# Altium schematic sheet Analouge.SchDoc
size A3; DocumentNumber: 5; SheetNumber: 5; SheetTotal: 8
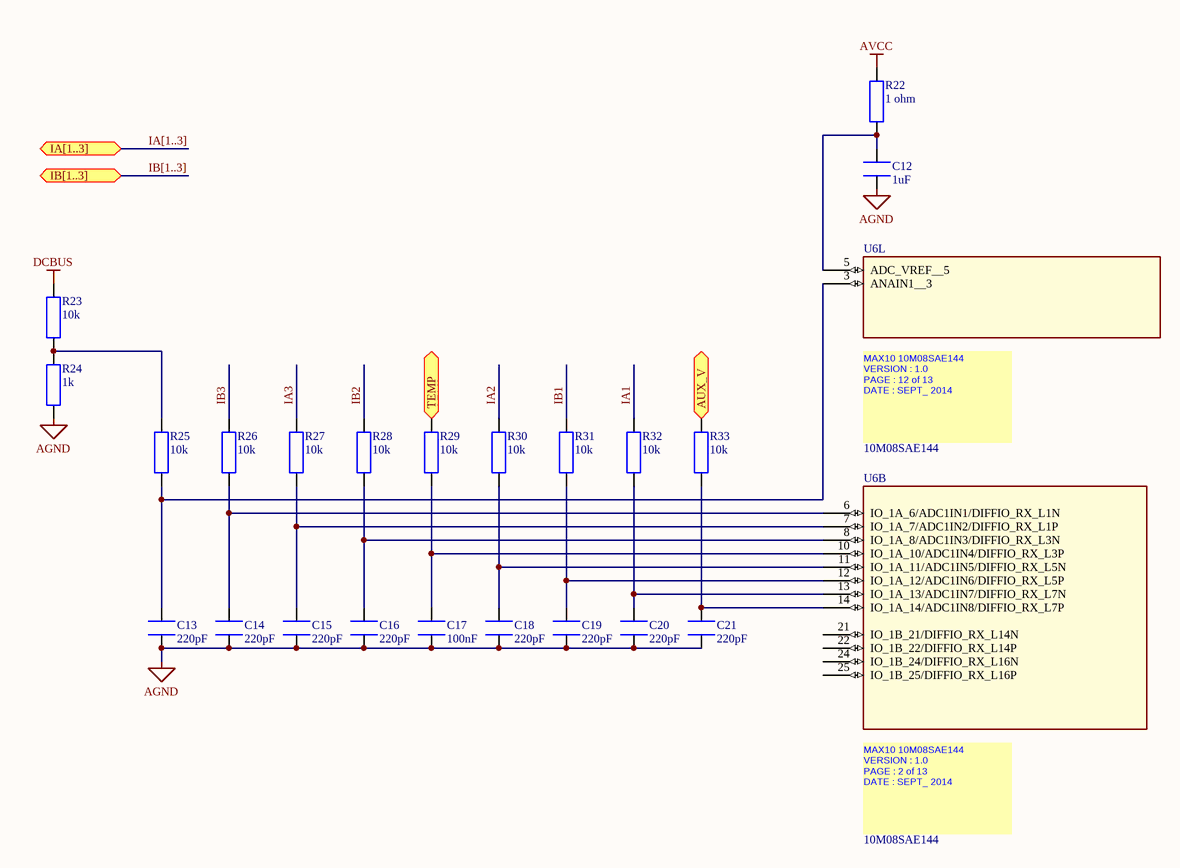
[diagram p0: Analouge.SchDoc]

## Parts
C12  value 1uF  [1608[0603]]  (hidden comment: MC0603X105K160)
C13  value 220pF  [1608[0603]]  (hidden comment: MC0603N221J500CT)
C14  value 220pF  [1608[0603]]  (hidden comment: MC0603N221J500CT)
C15  value 220pF  [1608[0603]]  (hidden comment: MC0603N221J500CT)
C16  value 220pF  [1608[0603]]  (hidden comment: MC0603N221J500CT)
C17  value 100nF  [1608[0603]]  (hidden comment: MC0603B104K160CT)
C18  value 220pF  [1608[0603]]  (hidden comment: MC0603N221J500CT)
C19  value 220pF  [1608[0603]]  (hidden comment: MC0603N221J500CT)
C20  value 220pF  [1608[0603]]  (hidden comment: MC0603N221J500CT)
C21  value 220pF  [1608[0603]]  (hidden comment: MC0603N221J500CT)
R22  value 1 ohm  [RESC1608X55N]  (hidden comment: MCWR06W1R00FTL)
R23  value 10k  [RESC1608X06L]  (hidden comment: MCMR06X1002FTL)
R24  value 1k  [RESC1608X55N]  (hidden comment: MCMR06X1001FTL)
R25  value 10k  [RESC1608X06L]  (hidden comment: MCMR06X1002FTL)
R26  value 10k  [RESC1608X06L]  (hidden comment: MCMR06X1002FTL)
R27  value 10k  [RESC1608X06L]  (hidden comment: MCMR06X1002FTL)
R28  value 10k  [RESC1608X06L]  (hidden comment: MCMR06X1002FTL)
R29  value 10k  [RESC1608X06L]  (hidden comment: MCMR06X1002FTL)
R30  value 10k  [RESC1608X06L]  (hidden comment: MCMR06X1002FTL)
R31  value 10k  [RESC1608X06L]  (hidden comment: MCMR06X1002FTL)
R32  value 10k  [RESC1608X06L]  (hidden comment: MCMR06X1002FTL)
R33  value 10k  [RESC1608X06L]  (hidden comment: MCMR06X1002FTL)
U6  10M08SAE144  [SQFP50P2200X2200X165_HS-145N]  (parts B,L of 13)

## Ports
AUX_V, IA[1..3], IB[1..3], TEMP

## Nets
AGND: C12.1 C13.1 C14.1 C15.1 C16.1 C17.1 C18.1 C19.1 C20.1 C21.1 R24.1
AVCC: R22.2
DCBUS: R23.2
AUX_V: R33.2 ; port AUX_V
IA1: R32.2
IA2: R30.2
IA3: R27.2
IB1: R31.2
IB2: R28.2
IB3: R26.2
TEMP: R29.2 ; port TEMP
NetC12_2: C12.2 R22.1 U6.5(ADC_VREF__5)
NetC13_2: C13.2 R25.1 U6.3(ANAIN1__3)
NetC14_2: C14.2 R26.1 U6.6(IO_1A_6/ADC1IN1/DIFFIO_RX_L1N)
NetC15_2: C15.2 R27.1 U6.7(IO_1A_7/ADC1IN2/DIFFIO_RX_L1P)
NetC16_2: C16.2 R28.1 U6.8(IO_1A_8/ADC1IN3/DIFFIO_RX_L3N)
NetC17_2: C17.2 R29.1 U6.10(IO_1A_10/ADC1IN4/DIFFIO_RX_L3P)
NetC18_2: C18.2 R30.1 U6.11(IO_1A_11/ADC1IN5/DIFFIO_RX_L5N)
NetC19_2: C19.2 R31.1 U6.12(IO_1A_12/ADC1IN6/DIFFIO_RX_L5P)
NetC20_2: C20.2 R32.1 U6.13(IO_1A_13/ADC1IN7/DIFFIO_RX_L7N)
NetC21_2: C21.2 R33.1 U6.14(IO_1A_14/ADC1IN8/DIFFIO_RX_L7P)
NetR23_1: R23.1 R24.2 R25.2

Not connected (* = marked no-connect by the designer): U6 21(IO_1B_21/DIFFIO_RX_L14N) 22(IO_1B_22/DIFFIO_RX_L14P) 24(IO_1B_24/DIFFIO_RX_L16N) 25(IO_1B_25/DIFFIO_RX_L16P)

## Buses and harness runs
bus IA[1..3] = port IA[1..3]
bus IB[1..3] = port IB[1..3]

## Notes on the sheet
- (in symbol 10M08SAE144, part B) MAX10 10M08SAE144 / VERSION : 1.0 / PAGE : 2 of 13 / DATE : SEPT_ 2014 /
- (in symbol 10M08SAE144, part L) MAX10 10M08SAE144 / VERSION : 1.0 / PAGE : 12 of 13 / DATE : SEPT_ 2014 /

## Library data of the parts
C12 = MC0603X105K160: CAP, MLCC, X5R, 1UF, 16V, 0603; Supplier 1: Farnell; Supplier Part Number 1: 2310630; Supplier 2: Farnell; Supplier Part Number 2: 1759407RL; Supplier 3: Farnell; Supplier Part Number 3: 1759407
C13-C16 C18-C21 = MC0603N221J500CT: CAP, MLCC, C0G/NP0, 220PF, 50V, 0603; Supplier 1: Farnell; Supplier Part Number 1: 1759071RL; Supplier 2: Farnell; Supplier Part Number 2: 2310581; Supplier 3: Farnell; Supplier Part Number 3: 1759071
C17 = MC0603B104K160CT: CAP, MLCC, X7R, 100NF, 16V, 0603; Supplier 1: Farnell; Supplier Part Number 1: 2310628; Supplier 2: Farnell; Supplier Part Number 2: 1759016RL; Supplier 3: Farnell; Supplier Part Number 3: 1759016
R22 = MCWR06W1R00FTL: RES, THICK FILM, 1OHM, 1%, 0.1W; Supplier 1: Farnell; Supplier 2: Farnell; Supplier Part Number 1: 2447289; Supplier Part Number 2: 2447289RL
R23 R25-R33 = MCMR06X1002FTL: Resistor, 10k, 0603; Supplier 1: Farnell; Supplier Part Number 1: 2073349; Supplier 2: Farnell; Supplier Part Number 2: 2073349RL
R24 = MCMR06X1001FTL: RESISTOR, CERAMIC, 1K, 0.1W, 1%; Supplier 1: Farnell; Supplier Part Number 1: 2073348; Supplier 2: Farnell; Supplier Part Number 2: 2073348RL
U6 = 10M08SAE144: SWAP_INFO: (S1+S2+S3+S4+S5+S6+S7+S8+S9+S10+S11+S12+S13); SPLIT_INST: TRUE